# Altium schematic sheet Sheet1.SchDoc
size A4; Author: D. GREER; DocumentNumber: TEST-1234
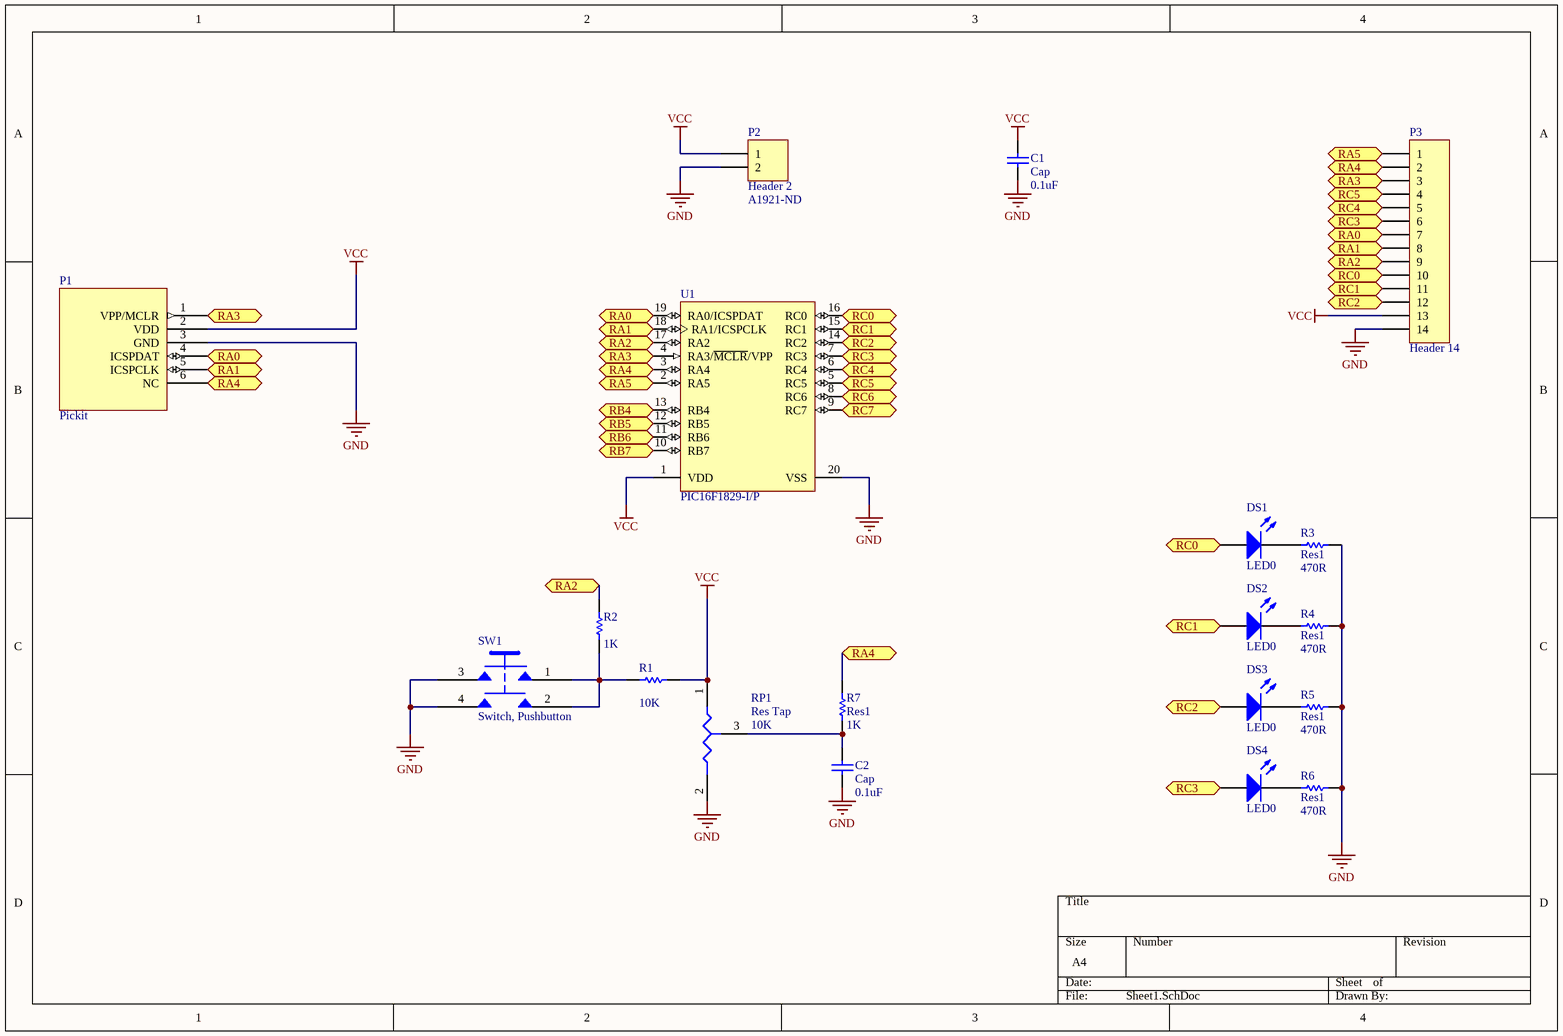
[diagram p0: Sheet1.SchDoc]

## Parts
C1  Cap  value 0.1uF  [CAP-0.1]
C2  Cap  value 0.1uF  [CAP-0.1]
DS1  LED0  [LED-0.1-Upright]
DS2  LED0  [LED-0.1-Upright]
DS3  LED0  [LED-0.1-Upright]
DS4  LED0  [LED-0.1-Upright]
P1  Pickit  [PICKIT HEADER]
P2  Header 2  Supplier Part Number 1: A1921-ND  [HDR1X2]
P3  Header 14  [HDR1X14]
R1  value 10K  [AXIAL-0.3]  (hidden comment: Res1)
R2  value 1K  [AXIAL-0.3]
R3  Res1  value 470R  [AXIAL-0.3]
R4  Res1  value 470R  [AXIAL-0.3]
R5  Res1  value 470R  [AXIAL-0.3]
R6  Res1  value 470R  [AXIAL-0.3]
R7  Res1  value 1K  [AXIAL-0.3]
RP1  Res Tap  value 10K  [TRIM-POT]
SW1  Switch, Pushbutton  [SW-PB2]
U1  PIC16F1829-I/P  [MCHP-PDIP-P20]

## Ports
RA0, RA0 (bidir), RA1, RA1 (bidir), RA2, RA2 (bidir), RA3, RA4, RA4 (bidir), RA5 (bidir), RB4 (bidir), RB5 (bidir), RB6 (bidir), RB7 (bidir), RC0 (bidir), RC1 (bidir), RC2 (bidir), RC3 (bidir), RC4 (bidir), RC5 (bidir), RC6 (bidir), RC7 (bidir)

## Nets
GND: C1.2 C2.2 P1.3(GND) P2.2 P3.14 R3.2 R4.2 R5.2 R6.2 RP1.2(B) SW1.3 SW1.4 U1.20(VSS)
VCC: C1.1 P1.2(VDD) P2.1 P3.13 R1.2 RP1.1(A) U1.1(VDD)
RA0: P1.4(ICSPDAT) P3.7 U1.19(RA0/ICSPDAT) ; port RA0
RA1: P1.5(ICSPCLK) P3.8 U1.18(RA1/ICSPCLK) ; port RA1
RA2: P3.9 R2.1 U1.17(RA2) ; port RA2
RA3: P1.1(VPP/MCLR) P3.3 U1.4(RA3/~{MCLR}/VPP) ; port RA3
RA4: P1.6(NC) P3.2 R7.1 U1.3(RA4) ; port RA4
RA5: P3.1 U1.2(RA5) ; port RA5
RB4: U1.13(RB4) ; port RB4
RB5: U1.12(RB5) ; port RB5
RB6: U1.11(RB6) ; port RB6
RB7: U1.10(RB7) ; port RB7
RC0: DS1.1(A) P3.10 U1.16(RC0) ; port RC0
RC1: DS2.1(A) P3.11 U1.15(RC1) ; port RC1
RC2: DS3.1(A) P3.12 U1.14(RC2) ; port RC2
RC3: DS4.1(A) P3.6 U1.7(RC3) ; port RC3
RC4: P3.5 U1.6(RC4) ; port RC4
RC5: P3.4 U1.5(RC5) ; port RC5
RC6: U1.8(RC6) ; port RC6
RC7: U1.9(RC7) ; port RC7
NetC2_1: C2.1 R7.2 RP1.3(TAP)
NetDS1_2: DS1.2(K) R3.1
NetDS2_2: DS2.2(K) R4.1
NetDS3_2: DS3.2(K) R5.1
NetDS4_2: DS4.2(K) R6.1
NetR1_1: R1.1 R2.2 SW1.1 SW1.2

## Library data of the parts
C1 C2 = Cap: Capacitor; Published: 8-Jun-2000; LatestRevisionDate: 17-Jul-2002; LatestRevisionNote: Re-released for DXP Platform.; PackageReference: RAD-0.3; Publisher: Altium Limited; PackageDescription: Radial Cap, Thru-Hole; 2 Leads; 0.3 in Pin Spacing; Supplier 1: Mouser; Supplier Part Number 1: 80-C0805C104J5RAUTO
DS1-DS4 = LED0: Typical INFRARED GaAs LED; Published: 8-Jun-2000; LatestRevisionDate: 08-Jul-2005; LatestRevisionNote: Mech Layer 1 removed.; PackageReference: LED-0; Publisher: Altium Limited; PackageDescription: LED; 2 Leads
P2 = Header 2: Header, 2-Pin; LatestRevisionDate: 17-Jul-2002; LatestRevisionNote: Re-released for DXP Platform.; Publisher: Altium Limited; Supplier 1: Digi-Key
P3 = Header 14: Header, 14-Pin; LatestRevisionDate: 17-Jul-2002; LatestRevisionNote: Re-released for DXP Platform.; Publisher: Altium Limited
R1-R7 = Res1: Resistor; Published: 8-Jun-2000; LatestRevisionDate: 17-Jul-2002; LatestRevisionNote: Re-released for DXP Platform.; PackageReference: AXIAL-0.3; Publisher: Altium Limited; PackageDescription: Axial Device, Thru-Hole; 2 Leads; 0.3 in Pin Spacing
RP1 = Res Tap: Tapped Resistor; pin to pad: 2>3 3>2; Sim Note: Enter the Resistance value and the set point into parameter fields.; Set Position: 0.5; Published: 24-Mar-1999; LatestRevisionDate: 17-Jul-2002; LatestRevisionNote: Re-released for DXP Platform.; PackageReference: VR3; Publisher: Altium Limited; PackageDescription: Variable Resistor, Thru-Hole; 3 Leads
U1 = CMP-0115-01811-1: Flash Microcontroller with XLP Technology, 32 MHz, 17 I/O, -40 to 85 degC, 20-pin PDIP (P20), Tube; Manufacturer: Microchip; EEPROM Data Memory (bytes): 256; Operation Voltage Range: 1.8V - 5.5V; I/O Pins: 17; Program Memory KBytes: 14; Program Memory KWords: 8; Internal Oscillator: 32 MHz, 31 kHz; RAM: 1024; # of A/D Channels: 12; Timers: 4 - 8-bit, 1 - 16-bit; Max. CPU Speed MHz: 32; Digital Communication: 1 -A/E/USART, 2 -MSSP(SPI/I2C); Memory Type: Flash; ComponentLink1URL: http://ww1.microchip.com/downloads/en/DeviceDoc/41440C.pdf; PackageReference: PDIP-P20; PackageDescription: 20-Lead Plastic Dual In-Line, Row Spacing 7.62 mm, 25.91 x 6.6 mm Body, 2.54 mm Pitch; PartNumber: PIC16F1829-I/P; ComponentLink1Description: Datasheet; PackageVersion: C04-019B, 12/2012; ComponentLink3Description: URL Link1; Packing: TUBE; ComponentLink2Description: Package Specification; ComponentLink3URL: Product URL:http://www.microchip.com/datasheet/PIC16F1829; DatasheetVersion: Rev. C; ComponentLink2URL: http://www.microchip.com/stellent/groups/techpub_sg/documents/packagingspec/en012702.pdf; RoHS: TRUE; Mounting Technology: Through Hole